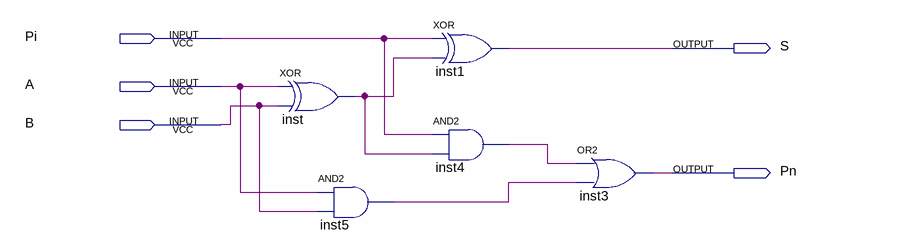
[diagram p0: schematic sheet]
// Quartus schematic FA.bdf as structural Verilog: 5 symbols, 5 pins
module FA (
  input  Pi,
  input  A,
  input  B,
  output S,
  output Pn
);

  wire inst4_out, inst5_out, inst_out;

  xor inst (inst_out, A, B);
  and inst5 (inst5_out, A, B);
  xor inst1 (S, Pi, inst_out);
  and inst4 (inst4_out, Pi, inst_out);
  or inst3 (Pn, inst4_out, inst5_out);
endmodule
